# EAGLE design chip-maestro (EAGLE 6.1)
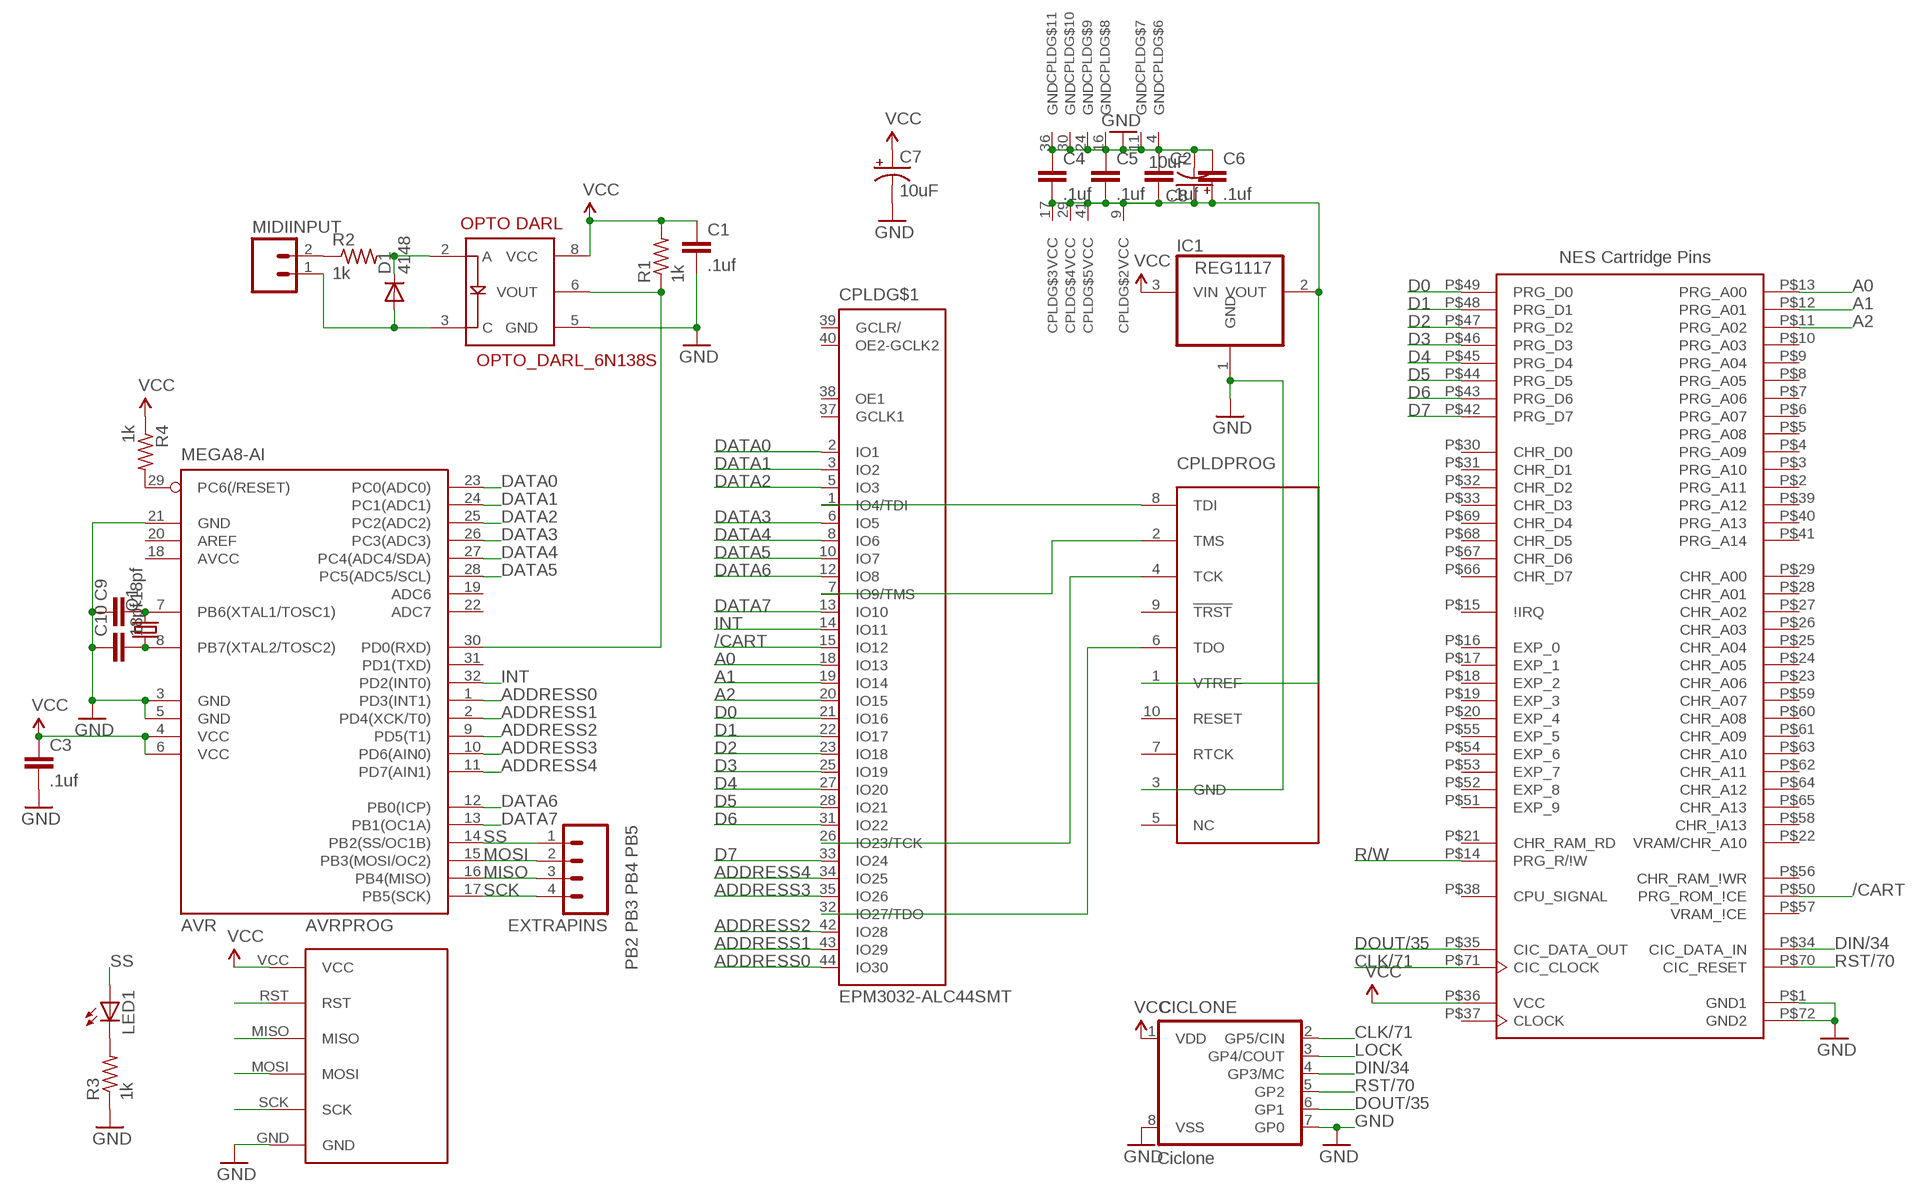
[diagram p0: schematic, sheet 1]

## Parts
AVR  MEGA8-AI  [TQFP32-08]
AVRPROG  6PIN  [6PIN]
C1  .1uf  C-EUC0805K  [C0805K]
C2  .1uf  C-EUC0805K  [C0805K]
C3  .1uf  C-EUC0805K  [C0805K]
C4  .1uf  C-EUC0805K  [C0805K]
C5  .1uf  C-EUC0805K  [C0805K]
C6  .1uf  C-EUC0805K  [C0805K]
C7  10uF  10UF-TANT  [EIA3216]
C8  10uF  10UF-TANT  [EIA3216]
C9  18pf  C-EUC0805K  [C0805K]
C10  18pf  C-EUC0805K  [C0805K]
CICLONE  Ciclone  PIC12C508JN  [DIL8]
CPLD  EPM3032-ALC44SMT  [TQFP44]
CPLDPROG  TC2050-MCP-NL  [TC2030-MCP-NL]
D1  4148  DIODESOT23  [SOT23-3]
EXTRAPINS  PB2 PB3 PB4 PB5  M04PTH  [1X04]
IC1  REG1117  [SOT223]
LED1  LEDCHIP-LED0805  [CHIP-LED0805]
MIDIINPUT  M02JST-PTH-2  [JST-2-PTH]
NESCARTPINS  NES-EDGE'  [NES-EDGE]
OPTO  OPTO_DARL_6N138S  [8-SMD]
Q1  CRYSTALHC49UP  [HC49UP]
R1  1k  R-US_M0805  [M0805]
R2  1k  R-US_M0805  [M0805]
R3  1k  R-US_M0805  [M0805]
R4  1k  R-US_M0805  [M0805]

## Nets
/CART: CPLD.15(IO12) NESCARTPINS.P$50(PRG_ROM_\!CE)
A0: CPLD.18(IO13) NESCARTPINS.P$13(PRG_A00)
A1: CPLD.19(IO14) NESCARTPINS.P$12(PRG_A01)
A2: CPLD.20(IO15) NESCARTPINS.P$11(PRG_A02)
ADDRESS0: AVR.1(PD3(INT1)) CPLD.44(IO30)
ADDRESS1: AVR.2(PD4(XCK/T0)) CPLD.43(IO29)
ADDRESS2: AVR.9(PD5(T1)) CPLD.42(IO28)
ADDRESS3: AVR.10(PD6(AIN0)) CPLD.35(IO26)
ADDRESS4: AVR.11(PD7(AIN1)) CPLD.34(IO25)
CLK/71: CICLONE.2(GP5/CIN) NESCARTPINS.P$71(CIC_CLOCK)
D0: CPLD.21(IO16) NESCARTPINS.P$49(PRG_D0)
D1: CPLD.22(IO17) NESCARTPINS.P$48(PRG_D1)
D2: CPLD.23(IO18) NESCARTPINS.P$47(PRG_D2)
D3: CPLD.25(IO19) NESCARTPINS.P$46(PRG_D3)
D4: CPLD.27(IO20) NESCARTPINS.P$45(PRG_D4)
D5: CPLD.28(IO21) NESCARTPINS.P$44(PRG_D5)
D6: CPLD.31(IO22) NESCARTPINS.P$43(PRG_D6)
D7: CPLD.33(IO24) NESCARTPINS.P$42(PRG_D7)
DATA0: AVR.23(PC0(ADC0)) CPLD.2(IO1)
DATA1: AVR.24(PC1(ADC1)) CPLD.3(IO2)
DATA2: AVR.25(PC2(ADC2)) CPLD.5(IO3)
DATA3: AVR.26(PC3(ADC3)) CPLD.6(IO5)
DATA4: AVR.27(PC4(ADC4/SDA)) CPLD.8(IO6)
DATA5: AVR.28(PC5(ADC5/SCL)) CPLD.10(IO7)
DATA6: AVR.12(PB0(ICP)) CPLD.12(IO8)
DATA7: AVR.13(PB1(OC1A)) CPLD.13(IO10)
DIN/34: CICLONE.4(GP3/MC) NESCARTPINS.P$34(CIC_DATA_IN)
DOUT/35: CICLONE.6(GP1) NESCARTPINS.P$35(CIC_DATA_OUT)
GND: AVR.3(GND) AVR.5(GND) AVR.21(GND) AVRPROG.GND C1.2 C2.1 C3.2 C4.1 C5.1 C6.1 C7.C(-) C8.C(-) C9.1 C10.1 CICLONE.7(GP0) CICLONE.8(VSS) CPLD.4(GND) CPLD.11(GND) CPLD.16(GND) CPLD.24(GND) CPLD.30(GND) CPLD.36(GND) CPLDPROG.3(GND) IC1.1(GND) NESCARTPINS.P$1(GND1) NESCARTPINS.P$72(GND2) OPTO.5(GND) R3.1
INT: AVR.32(PD2(INT0)) CPLD.14(IO11)
LOCK: CICLONE.3(GP4/COUT)
MISO: AVR.16(PB4(MISO)) AVRPROG.MISO EXTRAPINS.3
MOSI: AVR.15(PB3(MOSI/OC2)) AVRPROG.MOSI EXTRAPINS.2
N$1: LED1.C R3.2
N$2: AVR.8(PB7(XTAL2/TOSC2)) C10.2 Q1.1
N$3: CPLD.26(IO23/TCK) CPLDPROG.4(TCK)
N$4: CPLD.32(IO27/TDO) CPLDPROG.6(TDO)
N$5: CPLD.1(IO4/TDI) CPLDPROG.8(TDI)
N$6: MIDIINPUT.2 R2.1
N$7: AVR.7(PB6(XTAL1/TOSC1)) C9.2 Q1.2
N$8: CPLD.7(IO9/TMS) CPLDPROG.2(TMS)
N$10: AVR.30(PD0(RXD)) OPTO.6(VOUT) R1.1
N$11: D1.3(C) OPTO.2(A) R2.2
N$12: D1.1(A) MIDIINPUT.1 OPTO.3(C)
R/W: NESCARTPINS.P$14(PRG_R/\!W)
RST: AVR.29(PC6(/RESET)) AVRPROG.RST R4.2
RST/70: CICLONE.5(GP2) NESCARTPINS.P$70(CIC_RESET)
SCK: AVR.17(PB5(SCK)) AVRPROG.SCK EXTRAPINS.4
SS: AVR.14(PB2(SS/OC1B)) EXTRAPINS.1 LED1.A
VCC: AVR.4(VCC) AVR.6(VCC) AVRPROG.VCC C1.1 C3.1 C7.A(+) CICLONE.1(VDD) IC1.3(VIN) NESCARTPINS.P$36(VCC) OPTO.8(VCC) R1.2 R4.1
VCC2: C2.2 C4.2 C5.2 C6.2 C8.A(+) CPLD.9(VCC) CPLD.17(VCC) CPLD.29(VCC) CPLD.41(VCC) CPLDPROG.1(VTREF) IC1.2(VOUT)
Unconnected: AVR.19(ADC6) AVR.20(AREF) AVR.22(ADC7) AVR.31(PD1(TXD)) CPLD.37(GCLK1) CPLD.38(OE1) CPLD.39(GCLR/) CPLD.40(OE2-GCLK2) CPLDPROG.5(NC) CPLDPROG.7(RTCK) CPLDPROG.9(!TRST) CPLDPROG.10(RESET) NESCARTPINS.P$2(PRG_A11) NESCARTPINS.P$3(PRG_A10) NESCARTPINS.P$4(PRG_A09) NESCARTPINS.P$5(PRG_A08) NESCARTPINS.P$6(PRG_A07) NESCARTPINS.P$7(PRG_A06) NESCARTPINS.P$8(PRG_A05) NESCARTPINS.P$9(PRG_A04) NESCARTPINS.P$10(PRG_A03) NESCARTPINS.P$15(\!IRQ) NESCARTPINS.P$16(EXP_0) NESCARTPINS.P$17(EXP_1) NESCARTPINS.P$18(EXP_2) NESCARTPINS.P$19(EXP_3) NESCARTPINS.P$20(EXP_4) NESCARTPINS.P$21(CHR_RAM_RD) NESCARTPINS.P$22(VRAM/CHR_A10) NESCARTPINS.P$23(CHR_A06) NESCARTPINS.P$24(CHR_A05) NESCARTPINS.P$25(CHR_A04) NESCARTPINS.P$26(CHR_A03) NESCARTPINS.P$27(CHR_A02) NESCARTPINS.P$28(CHR_A01) NESCARTPINS.P$29(CHR_A00) NESCARTPINS.P$30(CHR_D0) NESCARTPINS.P$31(CHR_D1) NESCARTPINS.P$32(CHR_D2) NESCARTPINS.P$33(CHR_D3) NESCARTPINS.P$37(CLOCK) NESCARTPINS.P$38(CPU_SIGNAL) NESCARTPINS.P$39(PRG_A12) NESCARTPINS.P$40(PRG_A13) NESCARTPINS.P$41(PRG_A14) NESCARTPINS.P$51(EXP_9) NESCARTPINS.P$52(EXP_8) NESCARTPINS.P$53(EXP_7) NESCARTPINS.P$54(EXP_6) NESCARTPINS.P$55(EXP_5) NESCARTPINS.P$56(CHR_RAM_\!WR) NESCARTPINS.P$57(VRAM_\!CE) NESCARTPINS.P$58(CHR_\!A13) NESCARTPINS.P$59(CHR_A07) NESCARTPINS.P$60(CHR_A08) NESCARTPINS.P$61(CHR_A09) NESCARTPINS.P$62(CHR_A11) NESCARTPINS.P$63(CHR_A10) NESCARTPINS.P$64(CHR_A12) NESCARTPINS.P$65(CHR_A13) NESCARTPINS.P$66(CHR_D7) NESCARTPINS.P$67(CHR_D6) NESCARTPINS.P$68(CHR_D5) NESCARTPINS.P$69(CHR_D4)

## Notes on the sheet
- NES Cartridge Pins

## Power pins joined to a net without a drawn wire
AVCC: AVR.18(AVCC)

## Library data of the parts
AVR = atmel:MEGA8: MICROCONTROLLER 8 Kbytes FLASH, 1 kbytes SRAM, 512 bytes EEPROM, USART, 6-channel 10 bit ADC, 2-channel 8 bit ADC Pin compatible with Atmega48, ATMega88, ATMega168 Source: avr.lbr
AVRPROG = TC2050:6PIN
C1-C6 C9 C10 = rcl:C-EU: CAPACITOR, European symbol
C7 C8 = SparkFun-Capacitors:10UF-TANT: 10uF Tantalum SMT CAP-00811- 16V 10% (EIA-3216); PROD_ID: CAP-00811
CICLONE = microchip:PIC12C*?: MICROCONTROLLER
CPLD = altera2:EPM3032-ALC44
CPLDPROG = TC2050:TC2050: TAG-CONNECT ISP Connector Manufacturer: Tag-Connect <www.tag-connect.com> Cable for easy In-Circuit PCB Programming. Designed for JTAG 10 pin, suitable for many others. Pin Connection for TC2050 NL. PAD Description 1 VTREF 2 TMS 3 GND 4 TCK 5 NC 6 TDO 7 RTCK 8 TDI 9 !TRST 10 RESET ©2009 ROFA.cz Modified 7/2011 by Tim McCarthy-Smith VIDA Products INC
D1 = SparkFun-DiscreteSemi:DIODE: Diode These are standard reverse protection diodes and small signal diodes. SMA package can handle up to about 1A. SOD-323 can handle about 200mA. What the SOD-323 package when ordering, there are some mfgs out there that are 5-pin packages.
EXTRAPINS = SparkFun:M04: Header 4 Standard 4-pin 0.1" header. Use with straight break away headers (SKU : PRT-00116), right angle break away headers (PRT-00553), swiss pins (PRT-00743), machine pins (PRT-00117), and female headers (PRT-00115). Molex polarized connector foot print use with SKU : PRT-08231 with associated crimp pins and housings.
IC1 = burr-brown:REG1117: 800mA and 1A Low Dropout (LDO) Positive Regulator 1.8V, 2.5V, 2.85V, 3.3V, 5V, and Adj; MPN: REG1117; OC_FARNELL: 1097566; OC_NEWARK: 14P6981
LED1 = adafruit:LED: LED OSRAM: - CHIPLED LG R971, LG N971, LY N971, LG Q971, LY Q971, LO R971, LY R971 LH N974, LH R974 LS Q976, LO Q976, LY Q976 LO Q996 - Hyper CHIPLED LW Q18S LB Q993, LB Q99A, LB R99A - SideLED LS A670, LO A670, LY A670, LG A670, LP A670 LB A673, LV A673, LT A673, LW A673 LH A674 LY A675 LS A676, LA A676, LO A676, LY A676, LW A676 LS A679, LY A679, LG A679 - Hyper Micro SIDELED® LS Y876, LA Y876, LO Y876, LY Y876 LT Y87S - SmartLED LW L88C, LW L88S LB L89C, LB L89S, LG L890 LS L89K, LO L89K, LY L89K LS L896, LA L896, LO L896, LY L896 - TOPLED LS T670, LO T670, LY T670, LG T670, LP T670 LSG T670, LSP T670, LSY T670, LOP T670, LYG T670 LG T671, LOG T671, LSG T671 LB T673, LV T673, LT T673, LW T673 LH T674 LS T676, LA T676, LO T676, LY T676, LB T676, LH T676, LSB T676, LW T676 LB T67C, LV T67C, LT T67C, LS T67K, LO T67K, LY T67K, LW E67C LS E67B, LA E67B, LO E67B, LY E67B, LB E67C, LV E67C, LT E67C LW T67C LS T679, LY T679, LG T679 LS T770, LO T770, LY T770, LG T770, LP T770 LB T773, LV T773, LT T773, LW T773 LH T774 LS E675, LA E675, LY E675, LS T675 LS T776, LA T776, LO T776, LY T776, LB T776 LHGB T686 LT T68C, LB T68C - Hyper Mini TOPLED® LB M676 - Mini TOPLED Santana® LG M470 LS M47K, LO M47K, LY M47K Source: http://www.osram.convergy.de/
MIDIINPUT = SparkFun-Connectors:M02: Header 2 Standard 2-pin 0.1" header. Use with straight break away headers (SKU : PRT-00116), right angle break away headers (PRT-00553), swiss pins (PRT-00743), machine pins (PRT-00117), and female headers (PRT-00115). Molex polarized connector foot print use with SKU : PRT-08233 with associated crimp pins and housings.
NESCARTPINS = nintendo_nes_cartedge:NES-EDGE
OPTO = SparkFun-DiscreteSemi:OPTO_DARL_6N138S: Optoisolator, darlington pair output
Q1 = crystal:CRYSTAL: CRYSTAL; OC_FARNELL: unknown; OC_NEWARK: unknown
R1-R4 = rcl:R-US_: RESISTOR, American symbol

## Board
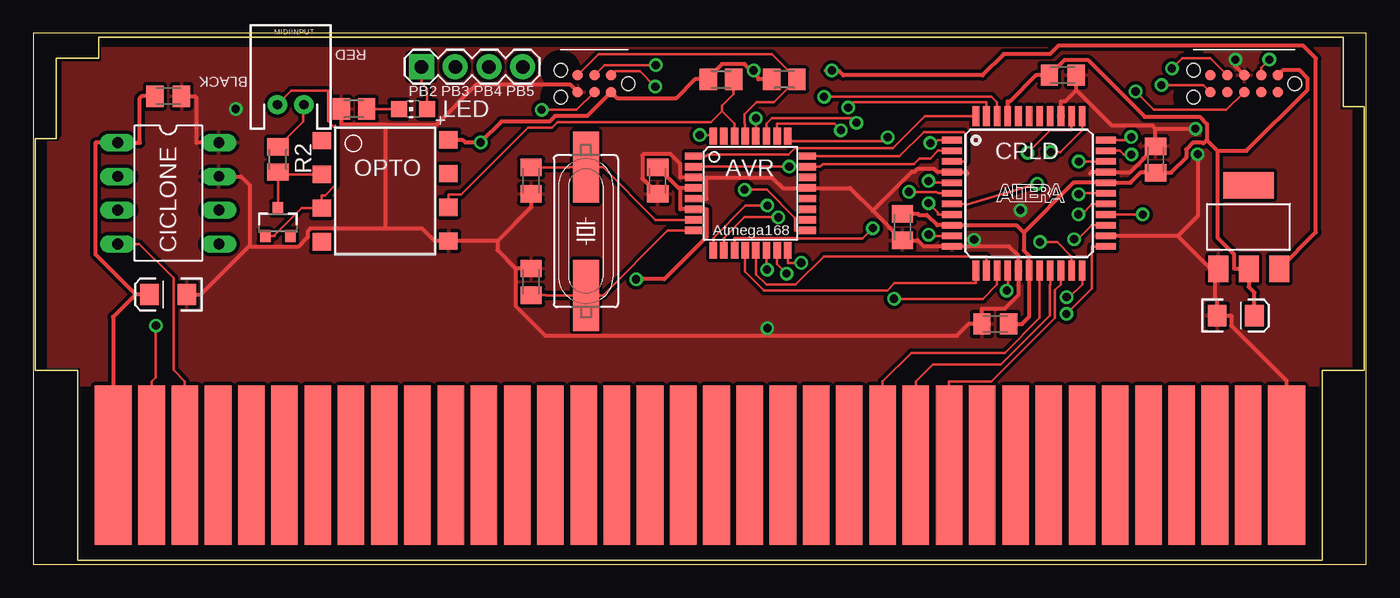
[diagram p1: board, top side]
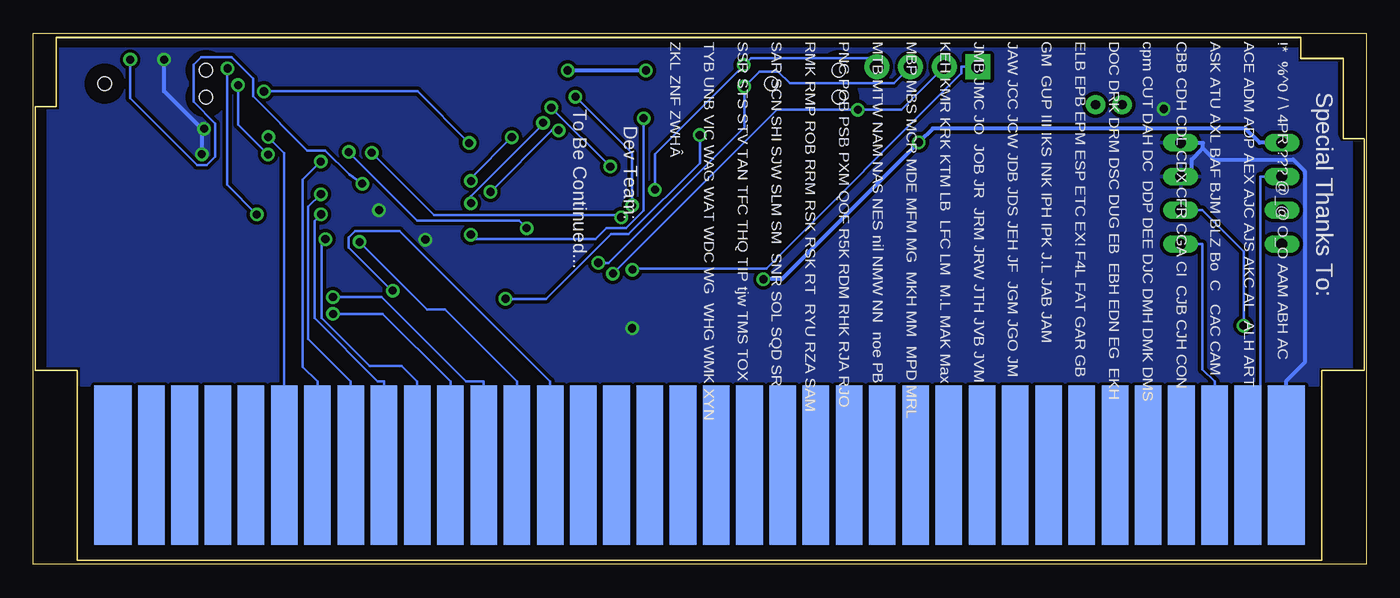
[diagram p2: board, bottom side, seen from below]

Size 100.31 x 39.99 mm. Coordinates in mm from the lower left corner, seen from the top.
Outline: 0,0 100.31,0 100.31,39.99 0,39.99 0,0
Copper layers (1*16): Top 0.035mm / dielectric 1.5mm / Bottom 0.035mm
Design rules: minimum track width 8mil, minimum drill 24mil, track to track 8mil, track to pad 8mil, pad to pad 8mil, via to via 8mil, smd to smd 8mil, copper to edge 40mil, drill to drill 8mil, minimum pad ring 10mil, minimum via ring 8mil, stop-mask expansion 4mil, vias tented up to drill 25mil, thermal gap 10mil
tKeepout: area 0,0 to 3.3,14.5; area 0,14.5 to 0.1,32.1; area 0,32.1 to 1.7,38.2; area 0,38.2 to 4.9,40; area 4.9,39.8 to 98.6,40; area 98.6,34.5 to 100.3,40; area 100.2,14.5 to 100.3,34.5; area 97.1,0.3 to 100.3,14.5; area 3.3,0 to 100.3,0.3
Milling: 14 lines

### Footprints (pad centres in the part's own frame; a part is rotated, then mirrored left to right if it is on the bottom)
TQFP32-08 = smd 1.27 x 0.559: 1 -4.293,2.8; 2 -4.293,2; 3 -4.293,1.2; 4 -4.293,0.4; 5 -4.293,-0.4; 6 -4.293,-1.2; 7 -4.293,-2; 8 -4.293,-2.8; 17 4.293,-2.8; 18 4.293,-2; 19 4.293,-1.2; 20 4.293,-0.4; 21 4.293,0.4; 22 4.293,1.2; 23 4.293,2; 24 4.293,2.8 | smd 0.559 x 1.27: 9 -2.8,-4.293; 10 -2,-4.293; 11 -1.2,-4.293; 12 -0.4,-4.293; 13 0.4,-4.293; 14 1.2,-4.293; 15 2,-4.293; 16 2.8,-4.293; 25 2.8,4.293; 26 2,4.293; 27 1.2,4.293; 28 0.4,4.293; 29 -0.4,4.293; 30 -1.2,4.293; 31 -2,4.293; 32 -2.8,4.293
6PIN = smd 0.787 x 0.787: GND 1.27,0.635; MISO -1.27,-0.635; MOSI 0,0.635; RST 1.27,-0.635; SCK 0,-0.635; VCC -1.27,0.635 | hole 1: -2.54,0; 2.54,-1.016; 2.54,1.016
C0805K = smd 1.3 x 1.6: 1 -1,0; 2 1,0
EIA3216 = smd 1.4 x 1.6: A 1.4,0; C -1.4,0
DIL8 = drill 0.813 long: 1 -3.81,-3.81; 2 -1.27,-3.81; 3 1.27,-3.81; 4 3.81,-3.81; 5 3.81,3.81; 6 1.27,3.81; 7 -1.27,3.81; 8 -3.81,3.81
TQFP44 = smd 1.5 x 0.5: 1 -5.8,4; 2 -5.8,3.2; 3 -5.8,2.4; 4 -5.8,1.6; 5 -5.8,0.8; 6 -5.8,0; 7 -5.8,-0.8; 8 -5.8,-1.6; 9 -5.8,-2.4; 10 -5.8,-3.2; 11 -5.8,-4; 23 5.8,-4; 24 5.8,-3.2; 25 5.8,-2.4; 26 5.8,-1.6; 27 5.8,-0.8; 28 5.8,0; 29 5.8,0.8; 30 5.8,1.6; 31 5.8,2.4; 32 5.8,3.2; 33 5.8,4 | smd 0.5 x 1.5: 12 -4,-5.8; 13 -3.2,-5.8; 14 -2.4,-5.8; 15 -1.6,-5.8; 16 -0.8,-5.8; 17 0,-5.8; 18 0.8,-5.8; 19 1.6,-5.8; 20 2.4,-5.8; 21 3.2,-5.8; 22 4,-5.8; 34 4,5.8; 35 3.2,5.8; 36 2.4,5.8; 37 1.6,5.8; 38 0.8,5.8; 39 0,5.8; 40 -0.8,5.8; 41 -1.6,5.8; 42 -2.4,5.8; 43 -3.2,5.8; 44 -4,5.8
TC2030-MCP-NL = smd 0.787 x 0.787: 1 1.27,-0.635; 2 2.54,-0.635; 3 3.81,-0.635; 4 5.08,-0.635; 5 6.35,-0.635; 6 6.35,0.635; 7 5.08,0.635; 8 3.81,0.635; 9 2.54,0.635; 10 1.27,0.635 | hole 1: 0,0; 7.62,-1.016; 7.62,1.016
SOT23-3 = smd 0.8 x 0.9: 1 -0.95,-1; 2 0.95,-1; 3 0,1.1
1X04 = drill 1.016 pad 1.88 square: 1 0,0 | drill 1.016 pad 1.88: 2 2.54,0; 3 5.08,0; 4 7.62,0
SOT223 = smd 1.499 x 2.007: 1 -2.261,-3.15; 2 0.025,-3.15; 3 2.311,-3.15 | smd 3.81 x 2.007: 4 0,3.15
CHIP-LED0805 = smd 1.2 x 1.2: A 0,-1.05; C 0,1.05
JST-2-PTH = drill 0.7 pad 1.448: 1 -1,0; 2 1,0
NES-EDGE = smd 2.8 x 12: P$1 44.15,-10.319; P$36 -44.15,-10.319 | smd 2 x 12: P$2 41.25,-10.319; P$3 38.75,-10.319; P$4 36.25,-10.319; P$5 33.75,-10.319; P$6 31.25,-10.319; P$7 28.75,-10.319; P$8 26.25,-10.319; P$9 23.75,-10.319; P$10 21.25,-10.319; P$11 18.75,-10.319; P$12 16.25,-10.319; P$13 13.75,-10.319; P$14 11.25,-10.319; P$15 8.75,-10.319; P$16 6.25,-10.319; P$17 3.75,-10.319; P$18 1.25,-10.319; P$19 -1.25,-10.319; P$20 -3.75,-10.319; P$21 -6.25,-10.319; P$22 -8.75,-10.319; P$23 -11.25,-10.319; P$24 -13.75,-10.319; P$25 -16.25,-10.319; P$26 -18.75,-10.319; P$27 -21.25,-10.319; P$28 -23.75,-10.319; P$29 -26.25,-10.319; P$30 -28.75,-10.319; P$31 -31.25,-10.319; P$32 -33.75,-10.319; P$33 -36.25,-10.319; P$34 -38.75,-10.319; P$35 -41.25,-10.319 | smd 2.8 x 12 bottom: P$37 44.15,-10.319; P$72 -44.15,-10.319 | smd 2 x 12 bottom: P$38 41.25,-10.319; P$39 38.75,-10.319; P$40 36.25,-10.319; P$41 33.75,-10.319; P$42 31.25,-10.319; P$43 28.75,-10.319; P$44 26.25,-10.319; P$45 23.75,-10.319; P$46 21.25,-10.319; P$47 18.75,-10.319; P$48 16.25,-10.319; P$49 13.75,-10.319; P$50 11.25,-10.319; P$51 8.75,-10.319; P$52 6.25,-10.319; P$53 3.75,-10.319; P$54 1.25,-10.319; P$55 -1.25,-10.319; P$56 -3.75,-10.319; P$57 -6.25,-10.319; P$58 -8.75,-10.319; P$59 -11.25,-10.319; P$60 -13.75,-10.319; P$61 -16.25,-10.319; P$62 -18.75,-10.319; P$63 -21.25,-10.319; P$64 -23.75,-10.319; P$65 -26.25,-10.319; P$66 -28.75,-10.319; P$67 -31.25,-10.319; P$68 -33.75,-10.319; P$69 -36.25,-10.319; P$70 -38.75,-10.319; P$71 -41.25,-10.319
8-SMD = smd 1.3 x 1.4: 1 -3.96,-4.96; 2 -1.42,-4.96; 3 1.12,-4.96; 4 3.66,-4.96; 5 3.59,4.58; 6 1.05,4.58; 7 -1.49,4.58; 8 -4.03,4.58
HC49UP = smd 5.334 x 1.93: 1 -4.826,0; 2 4.826,0
M0805 = smd 1.3 x 1.6: 1 -0.95,0; 2 0.95,0

### Placement (x,y rotation side)
AVR  53.98,27.94 0 top
AVRPROG  42.23,36.2 180 top
C1  46.99,28.89 270 top
C2  84.45,30.48 270 top
C3  10.16,35.24 0 top
C4  77.47,36.83 180 top
C5  65.41,25.4 90 top
C6  72.39,18.1 0 top
C7  10.16,20.32 180 top
C8  90.49,18.73 0 top
C9  37.47,28.89 90 top
C10  37.47,21.27 270 top
CICLONE  10.16,27.94 270 top
CPLD  74.93,27.94 0 top
CPLDPROG  94.93,36.2 180 top
D1  18.41,25.72 0 top
EXTRAPINS  29.21,37.47 0 top
IC1  91.44,25.4 0 top
LED1  28.57,34.29 90 top
MIDIINPUT  19.37,34.61 0 top
NESCARTPINS  50.16,17.78 0 top
OPTO  26.67,27.94 270 top
Q1  41.59,25.08 90 top
R1  51.75,36.51 180 top
R2  18.41,30.48 270 top
R3  24.13,34.29 0 top
R4  56.52,36.51 0 top

### Tracks (layer width: path | path; a pad name or v marks a point on that pad's centre or on a via)
/CART  (via drill 0.61 pad 1.02)
  Top 0.203: CPLD.15 73.33,21.09 73.26,21.01 v73.26,20.62
  Bottom 0.203: NESCARTPINS.P$50 61.41,13.77 72.76,25.11 76.09,25.11 76.58,24.62 76.58,23.85 73.34,20.62 v73.26,20.62
A0
  Top 0.203: CPLD.18 75.73,18.55 73.11,15.93 66.08,15.93 63.91,13.77 NESCARTPINS.P$13
A1
  Top 0.203: 67.69,15.05 72.8,15.05 76.49,18.73 76.49,21.04 76.53,21.09 CPLD.19 | 67.69,15.05 | 67.69,15.05 66.42,13.77 NESCARTPINS.P$12
A2
  Top 0.203: CPLD.20 77.33,21.09 76.89,20.65 76.89,18.55 72.11,13.77 68.92,13.77 NESCARTPINS.P$11
ADDRESS0
  Top 0.203: CPLD.44 67.08,33.74 64.68,31.34 57.31,31.34 56.83,30.86 50.74,30.86 50.62,30.74 AVR.1
ADDRESS1  (via drill 0.61 pad 1.02)
  Top 0.203: v56.89,29.95 50.63,29.95 50.62,29.94 AVR.2 | v61.33,34.39 61.73,34.8 71.73,34.8 CPLD.43
  Bottom 0.203: v61.33,34.39 v56.89,29.95
ADDRESS2  (via drill 0.61 pad 1.02)
  Top 0.203: v55.24,27.02 53.61,27.02 51.17,24.59 AVR.9 | v59.5,35.21 72.12,35.21 72.53,34.8 CPLD.42
  Bottom 0.203: v59.5,35.21 55.24,30.95 v55.24,27.02 | v55.24,27.02
ADDRESS3  (via drill 0.61 pad 1.02)
  Top 0.203: v56.08,26.13 53.52,26.13 51.98,24.59 AVR.10 | v74.83,31 76.52,32.69 78.13,32.69 CPLD.35
  Bottom 0.203: v74.83,31 70.13,26.3 56.24,26.3 v56.08,26.13
ADDRESS4  (via drill 0.61 pad 1.02)
  Top 0.203: v63.18,25.32 62.41,24.54 57.46,24.54 57.41,24.59 52.77,24.59 AVR.11 | v76.56,31.04 77.29,31.04 78.93,32.69 CPLD.34
  Bottom 0.203: v76.56,31.04 71.41,25.89 63.75,25.89 v63.18,25.32
CLK/71
  Bottom 0.203: CICLONE.2 7.98,29.21 7.98,8.4 NESCARTPINS.P$71
D0  (via drill 0.61 pad 1.02)
  Top 0.203: v75.76,24.27 77.05,24.27 78.13,23.2 CPLD.21
  Bottom 0.203: v75.76,24.27 70.67,19.18 70.67,19.17 69.32,19.17 63.91,13.77 NESCARTPINS.P$49
D1  (via drill 0.61 pad 1.02)
  Top 0.203: v77.76,20.12 77.97,20.12 78.93,21.09 CPLD.22
  Bottom 0.203: v77.76,20.12 74.08,20.12 67.73,13.77 66.42,13.77 NESCARTPINS.P$48
D2  (via drill 0.61 pad 1.02)
  Top 0.203: v77.75,18.86 79.67,20.79 79.67,23.94 CPLD.23
  Bottom 0.203: v77.75,18.86 74.01,18.86 68.92,13.77 NESCARTPINS.P$47
D3  (via drill 0.61 pad 1.02)
  Top 0.203: v78.33,24.49 78.62,24.49 79.67,25.54 CPLD.25
  Bottom 0.203: 72.61,14.96 71.42,13.77 NESCARTPINS.P$46 | 72.61,14.96 | 72.61,14.96 75,14.96 78.59,18.55 78.59,24.23 v78.33,24.49
D4  (via drill 0.61 pad 1.02)
  Top 0.203: v78.65,26.36 78.89,26.36 79.67,27.14 CPLD.27
  Bottom 0.203: v78.65,26.36 79.15,25.85 79.15,18.54 74.38,13.77 73.92,13.77 NESCARTPINS.P$45
D5  (via drill 0.61 pad 1.02)
  Top 0.203: CPLD.28 78.73,27.94 v78.66,27.88
  Bottom 0.203: v78.66,27.88 79.61,26.93 79.61,16.96 76.42,13.77 NESCARTPINS.P$44
D6  (via drill 0.61 pad 1.02)
  Top 0.203: v78.67,30.33 v78.68,30.34 CPLD.31
  Bottom 0.203: v78.67,30.33 80.03,28.97 80.03,14.88 78.92,13.77 NESCARTPINS.P$43
D7  (via drill 0.61 pad 1.02)
  Top 0.203: CPLD.33 82.4,31.94 v82.63,32.17
  Bottom 0.203: NESCARTPINS.P$42 81.42,30.96 v82.63,32.17
DATA0
  Top 0.203: CPLD.2 68.08,31.14 67.5,30.56 66.67,30.56 66.27,30.16 59.42,30.16 59.21,29.94 AVR.23
DATA1
  Top 0.203: AVR.24 65.19,30.74 67.01,32.55 70.03,32.55 70.19,32.4 70.19,30.34 CPLD.3
DATA2  (via drill 0.61 pad 1.02)
  Top 0.203: CPLD.5 67.5,28.74 v67.38,28.87 | AVR.25 57.14,31.87 64.01,31.87 v64.3,32.16
  Bottom 0.203: v64.3,32.16 67.38,29.08 v67.38,28.87
DATA3  (via drill 0.61 pad 1.02)
  Top 0.203: v65.9,28.05 67.97,28.05 68.08,27.94 CPLD.6 | v60.78,32.69 60.29,33.17 55.98,33.17 AVR.26
  Bottom 0.203: v60.78,32.69 61.26,32.69 v65.9,28.05
DATA4  (via drill 0.61 pad 1.02)
  Top 0.203: v67.37,27.2 68.08,26.5 68.08,26.34 CPLD.8 | v61.95,33.25 61.62,33.58 55.58,33.58 55.17,33.17 AVR.27
  Bottom 0.203: v61.95,33.25 61.95,33.15 67.37,27.72 v67.37,27.2
DATA5  (via drill 0.61 pad 1.02)
  Top 0.203: AVR.28 v54.38,33.59 | v54.38,33.59 | CPLD.10 67.47,24.74 v67.38,24.82
  Bottom 0.203: v67.38,24.82 67.06,24.5 58,24.5 57.19,25.32 55.7,25.32 54.38,26.65 v54.38,33.59
DATA6
  Top 0.203: AVR.12 53.58,22.07 55,20.64 64.26,20.64 64.81,21.19 70.93,21.19 CPLD.12
DATA7
  Top 0.203: AVR.13 54.38,21.84 55.16,21.05 57.38,21.05 59.52,23.2 71.73,23.2 CPLD.13
DIN/34
  Top 0.203: CICLONE.4 7.98,24.13 10.55,21.55 10.55,14.63 11.41,13.77 NESCARTPINS.P$34
DOUT/35  (via drill 0.61 pad 1.02)
  Top 0.203: v9.23,17.99 9.23,14.08 8.91,13.77 NESCARTPINS.P$35
  Bottom 0.203: v9.23,17.99 9.23,23.56 12.34,26.67 CICLONE.6
GND  (via drill 0.61 pad 1.02)
  Top 0.305: 36.31,22.27 36.31,19.45 38.53,17.23 69.52,17.23 70.38,18.1 C6.1 71.39,19.25 73.12,19.25 74.13,20.27 CPLD.16 74.13,23.25 73.44,23.94 CPLD.11 67.02,23.94 66.56,24.4 C5.1 63.18,26.62 | 63.18,26.62 66.1,29.54 66.3,29.54 66.51,29.75 67.81,29.75 68.02,29.54 CPLD.4 70.24,29.54 70.33,29.44 | 84.45,32.8 84.22,33.03 81.17,33.03 78.53,35.67 78.47,35.67 | CPLDPROG.3 90.46,37.49 v90.46,38 | 50.67,29.14 55.61,29.14 56.41,28.34 AVR.21 61.47,28.34 63.18,26.62 | 50.67,29.14 50.67,27.54 AVR.5 | 50.67,29.14 AVR.3 48.69,29.14 48.69,30.14 47.94,30.9 45.94,30.9 45.83,30.79 45.83,29.05 C1.2 | C3.2 12.17,35.24 12.29,35.12 12.29,31.75 CICLONE.8 | 84.45,32.8 v87.45,32.8 | 84.45,32.8 C2.1 84.45,31.44 82.56,29.54 CPLD.30 79.62,29.54 79.53,29.44 | 86.14,24.74 CPLD.24 | 86.14,24.74 88.63,22.25 88.9,22.25 | v87.63,30.89 87.63,26.23 86.14,24.74 | 26.48,33.12 30.36,33.12 33.37,36.14 40.38,36.14 AVRPROG.GND | 26.48,33.12 26.47,33.13 23.18,33.13 R3.1 | 26.48,33.12 26.48,25.29 | 26.48,25.29 20.86,25.29 20.65,25.08 20.65,24.64 19.93,23.91 16.4,23.91 16.3,24.01 | 26.48,25.29 29.26,25.29 30.19,24.35 OPTO.5 34.93,24.35 | 16.3,24.01 12.62,20.32 C7.C | 16.3,24.01 16.3,28.55 15.65,29.21 CICLONE.7 | 34.93,24.35 34.93,23.65 36.31,22.27 | 34.93,24.35 37.47,26.89 C9.1 | C10.1 36.31,22.27 | 88.9,22.25 88.9,20.07 89.09,19.89 C8.C 90.14,18.73 90.14,17.99 94.31,13.82 NESCARTPINS.P$1 | IC1.1 88.9,22.25 | 78.47,35.67 77.64,34.85 77.33,34.85 CPLD.36 | C4.1 78.47,35.67
  Bottom 0.305: 87.63,32.8 90.46,35.62 v90.46,38 | 87.63,32.8 v87.63,30.89 | v87.45,32.8 87.63,32.8 | 12.29,31.33 12.29,31.75 CICLONE.8 | 13.13,30.49 13.13,29.21 CICLONE.7 | 13.13,30.49 | 13.13,30.49 12.29,31.33 | 12.29,31.33 11.44,30.48 5.5,30.48 4.64,29.61 4.64,15.19 6.01,13.82 NESCARTPINS.P$72
  other vias: 74.3,26.67 70.8,24.45 55.24,17.78 15.24,34.29
  pour Bottom (isolate 0.254): 5.14,37.88 5.14,39.53 98.33,39.47 98.33,34.19 99.92,34.19 99.92,14.89 96.74,14.89 96.74,13.43 3.56,13.43 3.56,14.83 0.38,14.83 0.38,31.85 1.91,31.85
  pour Top (isolate 0.254): 5.14,37.88 5.14,39.53 98.33,39.47 98.33,34.19 99.92,34.19 99.92,14.89 96.74,14.89 96.74,13.43 3.56,13.43 3.56,14.83 0.38,14.83 0.38,31.85 1.91,31.85
  pour Top: 2.54,32.07 2.22,32.07 2.22,37.78 5.08,37.78 5.08,33.66 3.81,33.66 3.81,32.07
  pour Bottom: 2.54,32.07 2.22,32.07 2.22,37.78 5.08,37.78 5.08,33.66 3.81,33.66 3.81,32.07
INT  (via drill 0.61 pad 1.02)
  Top 0.203: CPLD.14 72.53,21.09 71.44,20 v64.77,20 | v50.16,32.32 51.09,32.32 AVR.32
  Bottom 0.203: v64.77,20 61.73,20 56.84,24.88 55.5,24.88 50.16,30.23 v50.16,32.32
MISO  (via drill 0.61 pad 1.02)
  Top 0.203: v57.79,22.71 56.77,22.71 AVR.16 | AVRPROG.MISO 43.8,37.13 45.66,37.13 v46.81,35.98
  Bottom 0.203: v57.79,22.71 57.01,22.71 46.81,32.91 v46.81,35.98 45.67,37.11 44.28,37.11 43.38,36.21 35.54,36.21 EXTRAPINS.3
MOSI  (via drill 0.61 pad 1.02)
  Top 0.203: v56.7,21.89 55.98,22.61 AVR.15 | AVRPROG.MOSI 40.9,34.23 v38.27,34.23
  Bottom 0.203: v56.7,21.89 44.36,34.23 v38.27,34.23 34.99,34.23 EXTRAPINS.2
N$1
  Top 0.203: R3.2 LED1.C
N$2
  Top 0.203: AVR.8 47.75,25.14 42.86,20.26 Q1.1 38.59,20.26 38.57,20.27 C10.2
N$3  (via drill 0.61 pad 1.02)
  Top 0.203: CPLDPROG.4 88.56,38.12 86.46,38.12 v85.68,37.34 | v83.49,26.34 CPLD.26
  Bottom 0.203: v83.49,26.34 85.73,28.58 85.73,37.29 v85.68,37.34
N$4  (via drill 0.61 pad 1.02)
  Top 0.203: v82.64,30.86 82.06,30.86 81.78,31.14 CPLD.32 | CPLDPROG.6 88.06,36.09 v84.9,36.09
  Bottom 0.203: v84.9,36.09 84.9,33.12 v82.64,30.86
N$5  (via drill 0.61 pad 1.02)
  Top 0.203: v67.51,31.73 67.87,31.73 68.08,31.94 CPLD.1 | CPLDPROG.8 89.78,34.22 84.34,34.22 v82.95,35.61
  Bottom 0.203: v82.95,35.61 71.39,35.61 v67.51,31.73
N$6
  Top 0.203: R2.1 18.44,31.45 20.32,33.33 20.32,34.59 MIDIINPUT.2
N$7
  Top 0.203: AVR.7 46.83,25.94 42.86,29.91 Q1.2 40.32,29.91 40.31,29.89 C9.2
N$8  (via drill 0.61 pad 1.02)
  Top 0.203: CPLDPROG.2 92.39,37.38 v93.01,38 | v75.56,28.67 70.25,27.08 70.19,27.14 CPLD.7
  Bottom 0.203: v93.01,38 93.01,35.12 87.97,30.08 87.25,30.08 86.61,30.71 86.61,33.19 88.25,34.83 88.25,37.62 87.69,38.18 85.37,38.18 83.76,36.57 83.76,35.25 79.68,31.16 78.33,31.16 76.51,29.34 v75.56,28.67
N$10
  Top 0.203: 51.84,34.11 51.02,33.29 39.45,33.29 39.05,32.89 37.25,32.89 32.2,27.84 31.25,27.84 OPTO.6 | 51.84,34.11 51.84,34.54 52.7,35.41 R1.1 | 51.84,34.11 52.77,33.17 AVR.30
N$11
  Top 0.203: 18.41,29.36 D1.3 | 18.41,29.85 18.41,29.57 | 18.41,29.57 R2.2 | R2.2 18.41,29.36 | 18.41,29.36 OPTO.2 | R2.2 18.44,29.57 18.41,29.57
N$12
  Top 0.203: 22.72,32.92 22.72,28.55 21.95,27.77 21.71,27.77 OPTO.3 20.18,26.82 18.17,24.81 18.17,24.72 D1.1 | 22.72,32.92 22.72,33.02 | MIDIINPUT.1 18.39,34.65 19.41,35.66 22.2,35.66 22.2,33.38 22.66,32.92 22.72,32.92
RST
  Top 0.203: AVRPROG.RST 42.53,38.41 55.57,38.41 R4.2 55.74,34.79 54.41,34.79 53.52,33.91 53.52,33.23 53.58,33.17 AVR.29
RST/70
  Bottom 0.203: NESCARTPINS.P$70 11.41,13.77 12.34,14.7 12.34,24.13 CICLONE.5
SCK  (via drill 0.61 pad 1.02)
  Top 0.203: AVRPROG.SCK 42.99,37.59 v46.84,37.59 | v53.53,28.21 55.21,28.21 57.33,26.09 57.33,25.14 AVR.17
  Bottom 0.203: v53.53,28.21 53.53,30.9 v46.84,37.59 46.32,38.12 37.48,38.12 EXTRAPINS.4
SS  (via drill 0.61 pad 1.02)
  Top 0.203: v55.22,22.19 55.17,22.23 AVR.14 | EXTRAPINS.1 29.21,36.22 29.62,35.8 LED1.A
  Bottom 0.203: v55.22,22.19 55.12,22.28 45.14,22.28 30.45,36.97 30.45,37.47 EXTRAPINS.1
VCC  (via drill 0.61, 0.61 pad 1.02)
  Top 0.203: v60.1,37.19 59.59,37.19 59.69,37.15 | v54.2,37.19 54.11,37.09
  Top 0.305: v45.36,21.47 47.49,21.47 50.67,24.65 50.67,26.74 AVR.6 48.69,26.74 48.69,28.34 | C1.1 48.54,28.34 48.69,28.34 | AVR.4 48.69,28.34 | OPTO.8 32.31,31.97 32.5,31.78 v33.67,31.78 35.24,33.34 38.86,33.34 39.27,33.75 41.69,33.75 AVRPROG.VCC 43.94,35.12 48.4,35.12 49.8,36.51 R1.2 50.8,36.65 51.82,37.67 53.53,37.67 54.11,37.09 54.56,36.64 54.56,36.51 R4.1 | 7.7,20.32 6.01,18.63 NESCARTPINS.P$36 | C7.A 7.7,20.32 | 7.7,20.32 4.67,23.35 4.67,31.75 CICLONE.1 8.03,31.75 8.03,35.12 8.15,35.24 C3.1 | IC1.3 96.52,25.02 96.52,38.1 95.57,39.05 77.15,39.05 76.52,38.42 73.03,38.42 71.44,36.83 60.96,36.83 60.64,37.15 59.69,37.15
  Bottom 0.305: v45.36,21.47 43.98,21.47 v33.67,31.78 32.62,32.82 9.1,32.82 8.03,31.75 CICLONE.1 | v54.2,37.19 59.97,37.19 60.01,37.15 60.05,37.19 v60.1,37.19
VCC2
  Top 0.305: 74.53,24.99 74.53,23.65 74.93,23.25 CPLD.17 74.93,18.63 74.4,18.1 C6.2 | 74.53,24.99 78.28,28.74 CPLD.29 82.56,28.74 83.3,29.48 C2.2 85.61,29.48 86.77,30.64 86.77,31.25 87.28,31.75 87.99,31.75 88.05,31.7 88.3,31.96 | 74.53,24.99 73.98,25.54 CPLD.9 68.02,25.54 67.25,26.32 66.64,26.32 66.56,26.4 C5.2 | 88.3,31.96 88.31,31.97 88.31,33.15 87.77,33.69 83.63,33.69 79.34,37.99 77.63,37.99 C4.2 75.46,36.83 73.48,34.85 73.33,34.85 CPLD.41 | 89.11,31.15 88.3,31.96 | 89.11,31.15 89.11,24.6 90.36,23.36 90.36,22.25 IC1.2 91.47,20.89 91.89,20.47 C8.A | 89.11,31.15 91.29,31.15 95.9,35.76 95.9,36.59 95.29,37.2 94.03,37.2 CPLDPROG.1

### Text on the board
tOrigins: Tsundere | Jarek Lupinski | www.soniktech.com
tNames: RED | BLACK | PB2 PB3 PB4 PB5 | LED | CPLD | OPTO | AVR | Atmega168 | CICLONE
bNames: \!* %^0 / \\ 4PR ??? @_@ O_O AAM ABH AC | ACE ADM ADP AEX AJC AJS AKC AL ALH ART | ASK ATU AXL BAF BJM BLZ Bo C CAC CAM | CBB CDH CDL CDX CFR CGA CI CJB CJH CON | cpm CUT DAH DC DDP DEE DJC DMH DMK DMS | DOC DRK DRM DSC DUG EB EBH EDN EG EKH | ELB EPB EPM ESP ETC EX! F4L FAT GAR GB | GM GUP III IKS INK IPH IPK J.L JAB JAM | JAW JCC JCW JDB JDS JEH JF JGM JGO JM | JMB JMC JO JOB JR JRM JRW JTH JVB JVM | KEH KMR KRK KTM LB LFC LM M.L MAK Max | MBP MBS MCR MDE MFM MG MKH MM MPD MRL | MTB MTW NAM NAS NES nil NMW NN noe PB | PNC POB PSB PXM QOF R5K RDM RHK RJA RJO | RMK RMP ROB RRM RSK RSK RT RYU RZA SAM | SAR SCN SHI SJW SLM SM SNR SOL SQD SR | SSR STS STV TAN TFC THQ TIP tjw TMS TOX | TYB UNB VIC WAG WAT WDC WG WHG WMK XYN | ZKL ZNF ZWH | Special Thanks To: | To Be Continued... | Dev Team: | Â
tValues: - | MIDI | + | AVR ISP | JTAG